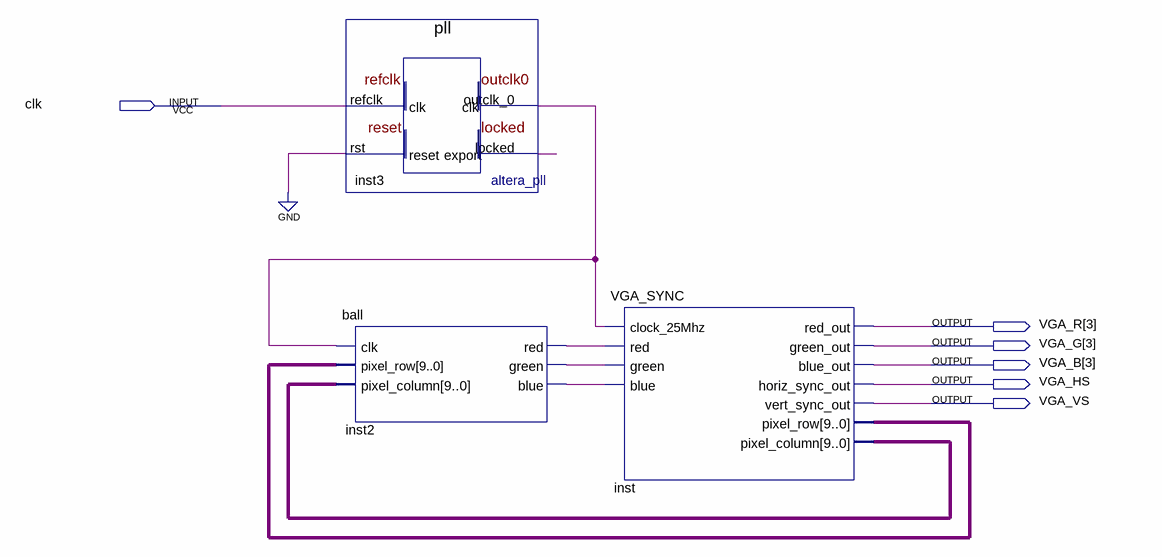
[diagram p0: schematic sheet]
// Quartus schematic VGA_Testing.bdf as structural Verilog: 3 symbols, 6 pins
module VGA_Testing (
  input  clk,
  output [3:3] VGA_R,
  output [3:3] VGA_G,
  output [3:3] VGA_B,
  output VGA_HS,
  output VGA_VS
);

  wire inst2_blue, inst2_green, inst2_red, inst3_locked, inst3_outclk_0;
  wire [9:0] inst_pixel_column, inst_pixel_row;

  pll inst3 (.refclk(clk), .rst(1'b0), .outclk_0(inst3_outclk_0), .locked(inst3_locked));
  ball inst2 (
    .clk(inst3_outclk_0), .pixel_row(inst_pixel_row), .pixel_column(inst_pixel_column), .red(inst2_red),
    .green(inst2_green), .blue(inst2_blue));
  VGA_SYNC inst (
    .clock_25Mhz(inst3_outclk_0), .red(inst2_red), .green(inst2_green), .blue(inst2_blue),
    .red_out(VGA_R[3]), .green_out(VGA_G[3]), .blue_out(VGA_B[3]), .horiz_sync_out(VGA_HS),
    .vert_sync_out(VGA_VS), .pixel_row(inst_pixel_row), .pixel_column(inst_pixel_column));
endmodule
